# EAGLE schematic PGTNX01_teensy (EAGLE 9.6.0)
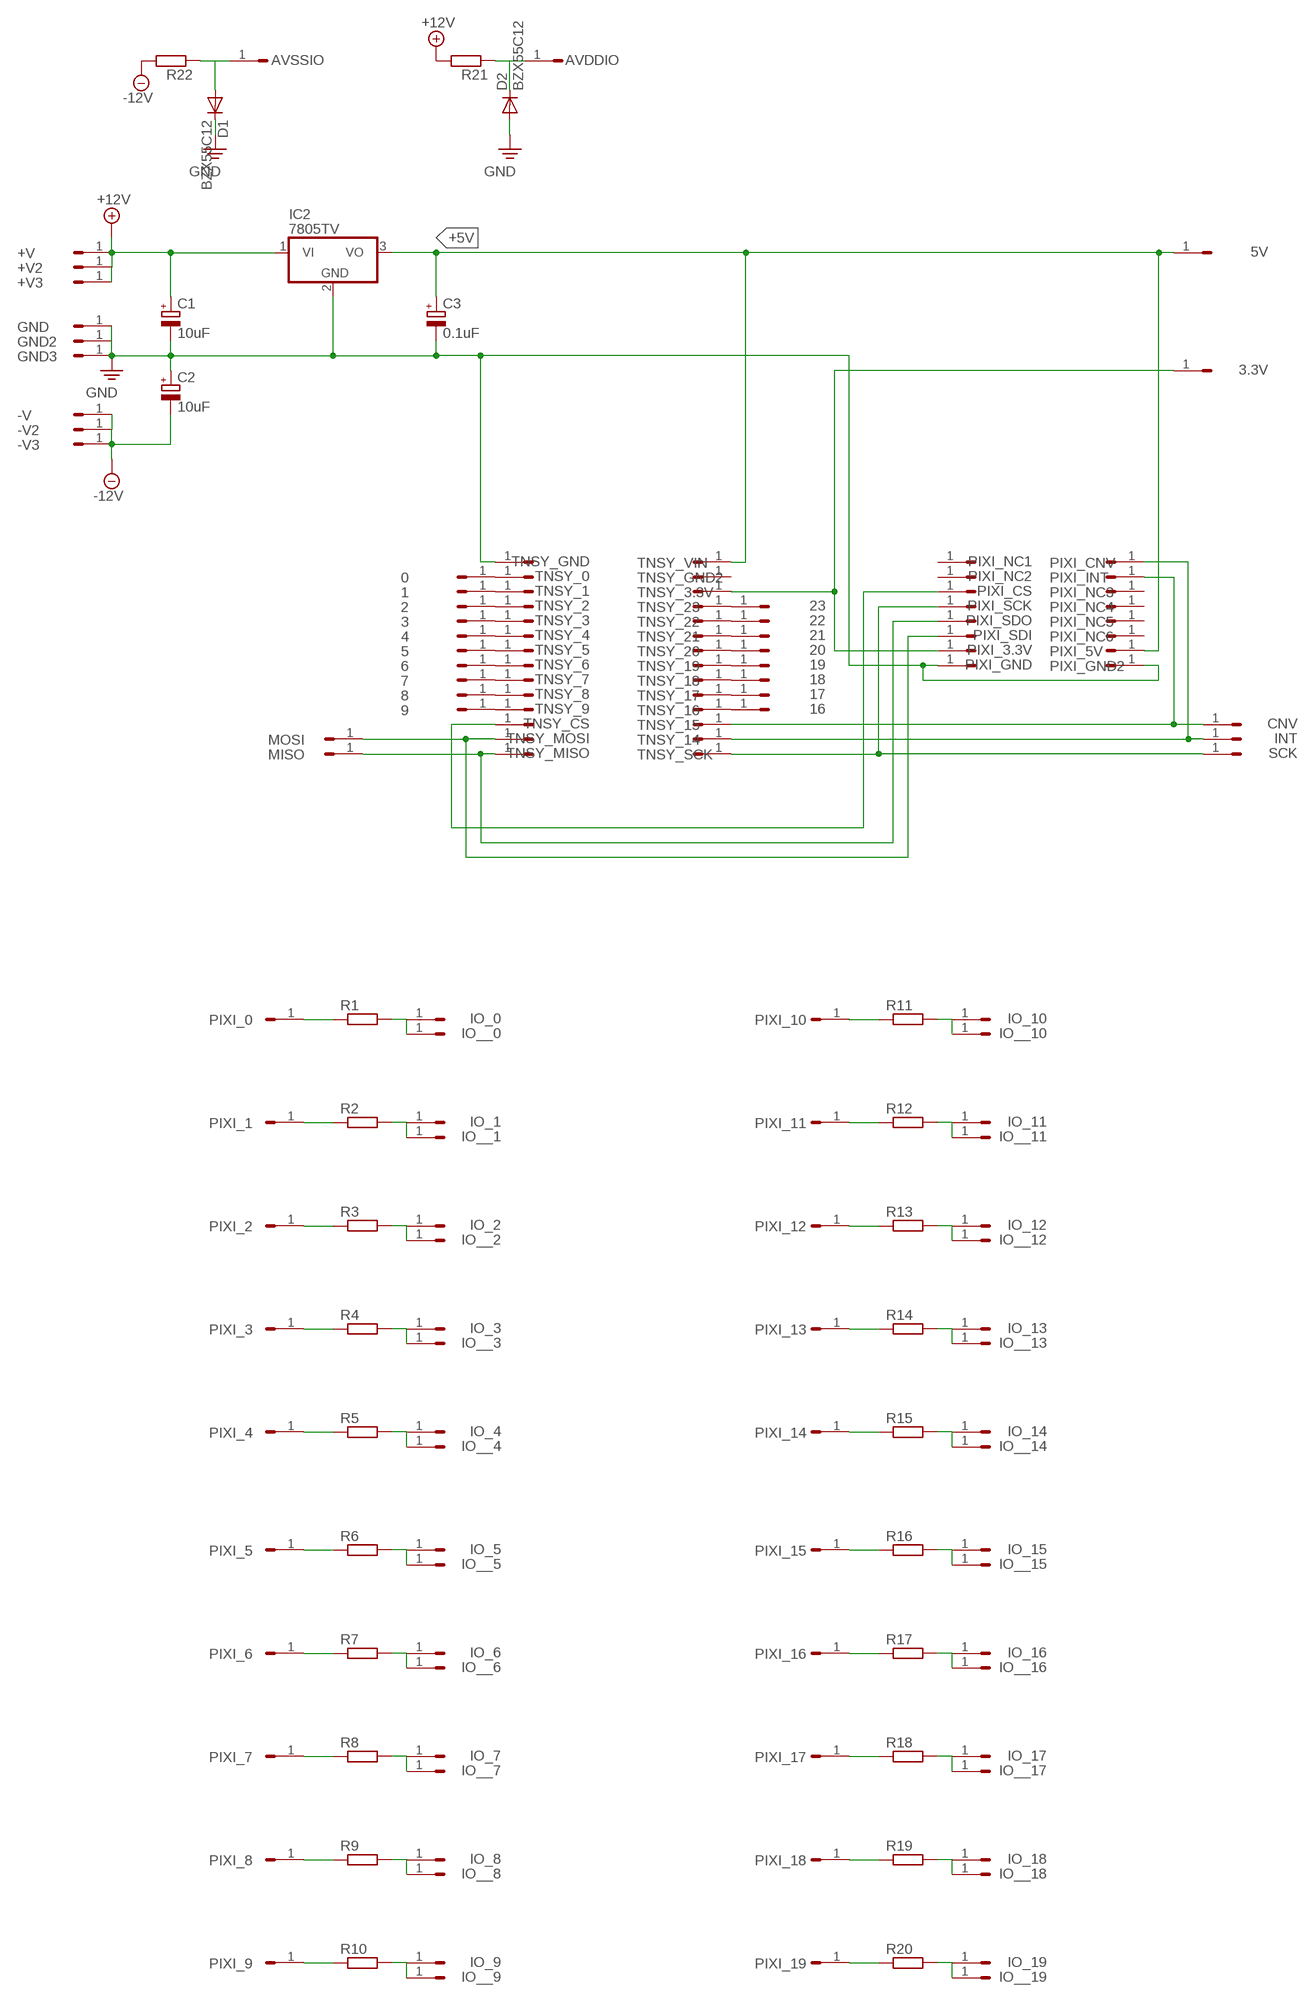
[diagram p0: schematic, sheet 1]

## Parts
0  HEADER/MALE/01  [HEADER/MALE/01]
1  HEADER/MALE/01  [HEADER/MALE/01]
2  HEADER/MALE/01  [HEADER/MALE/01]
3  HEADER/MALE/01  [HEADER/MALE/01]
3.3V  HEADER/MALE/01  [HEADER/MALE/01]
4  HEADER/MALE/01  [HEADER/MALE/01]
5  HEADER/MALE/01  [HEADER/MALE/01]
5V  HEADER/MALE/01  [HEADER/MALE/01]
6  HEADER/MALE/01  [HEADER/MALE/01]
7  HEADER/MALE/01  [HEADER/MALE/01]
8  HEADER/MALE/01  [HEADER/MALE/01]
9  HEADER/MALE/01  [HEADER/MALE/01]
16  HEADER/MALE/01  [HEADER/MALE/01]
17  HEADER/MALE/01  [HEADER/MALE/01]
18  HEADER/MALE/01  [HEADER/MALE/01]
19  HEADER/MALE/01  [HEADER/MALE/01]
20  HEADER/MALE/01  [HEADER/MALE/01]
21  HEADER/MALE/01  [HEADER/MALE/01]
22  HEADER/MALE/01  [HEADER/MALE/01]
23  HEADER/MALE/01  [HEADER/MALE/01]
+V  HEADER/MALE/01  [HEADER/MALE/01]
+V2  HEADER/MALE/01  [HEADER/MALE/01]
+V3  HEADER/MALE/01  [HEADER/MALE/01]
-V  HEADER/MALE/01  [HEADER/MALE/01]
-V2  HEADER/MALE/01  [HEADER/MALE/01]
-V3  HEADER/MALE/01  [HEADER/MALE/01]
AVDDIO  HEADER/MALE/01  [HEADER/MALE/01]
AVSSIO  HEADER/MALE/01  [HEADER/MALE/01]
C1  10uF  CAPACITOR/POLARIZEDE2.5-6  [E2,5-6]
C2  10uF  CAPACITOR/POLARIZEDE2.5-6  [E2,5-6]
C3  0.1uF  CAPACITOR/POLARIZEDE2.5-6  [E2,5-6]
CNV  HEADER/MALE/01  [HEADER/MALE/01]
D1  BZX55C12  1N4148DO35-7  [DO35-7]
D2  BZX55C12  1N4148DO35-7  [DO35-7]
GND  HEADER/MALE/01  [HEADER/MALE/01]
GND2  HEADER/MALE/01  [HEADER/MALE/01]
GND3  HEADER/MALE/01  [HEADER/MALE/01]
IC2  7805TV  [TO220V]
INT  HEADER/MALE/01  [HEADER/MALE/01]
IO_0  HEADER/MALE/01  [HEADER/MALE/01]
IO_1  HEADER/MALE/01  [HEADER/MALE/01]
IO_2  HEADER/MALE/01  [HEADER/MALE/01]
IO_3  HEADER/MALE/01  [HEADER/MALE/01]
IO_4  HEADER/MALE/01  [HEADER/MALE/01]
IO_5  HEADER/MALE/01  [HEADER/MALE/01]
IO_6  HEADER/MALE/01  [HEADER/MALE/01]
IO_7  HEADER/MALE/01  [HEADER/MALE/01]
IO_8  HEADER/MALE/01  [HEADER/MALE/01]
IO_9  HEADER/MALE/01  [HEADER/MALE/01]
IO_10  HEADER/MALE/01  [HEADER/MALE/01]
IO_11  HEADER/MALE/01  [HEADER/MALE/01]
IO_12  HEADER/MALE/01  [HEADER/MALE/01]
IO_13  HEADER/MALE/01  [HEADER/MALE/01]
IO_14  HEADER/MALE/01  [HEADER/MALE/01]
IO_15  HEADER/MALE/01  [HEADER/MALE/01]
IO_16  HEADER/MALE/01  [HEADER/MALE/01]
IO_17  HEADER/MALE/01  [HEADER/MALE/01]
IO_18  HEADER/MALE/01  [HEADER/MALE/01]
IO_19  HEADER/MALE/01  [HEADER/MALE/01]
IO__0  HEADER/MALE/01  [HEADER/MALE/01]
IO__1  HEADER/MALE/01  [HEADER/MALE/01]
IO__2  HEADER/MALE/01  [HEADER/MALE/01]
IO__3  HEADER/MALE/01  [HEADER/MALE/01]
IO__4  HEADER/MALE/01  [HEADER/MALE/01]
IO__5  HEADER/MALE/01  [HEADER/MALE/01]
IO__6  HEADER/MALE/01  [HEADER/MALE/01]
IO__7  HEADER/MALE/01  [HEADER/MALE/01]
IO__8  HEADER/MALE/01  [HEADER/MALE/01]
IO__9  HEADER/MALE/01  [HEADER/MALE/01]
IO__10  HEADER/MALE/01  [HEADER/MALE/01]
IO__11  HEADER/MALE/01  [HEADER/MALE/01]
IO__12  HEADER/MALE/01  [HEADER/MALE/01]
IO__13  HEADER/MALE/01  [HEADER/MALE/01]
IO__14  HEADER/MALE/01  [HEADER/MALE/01]
IO__15  HEADER/MALE/01  [HEADER/MALE/01]
IO__16  HEADER/MALE/01  [HEADER/MALE/01]
IO__17  HEADER/MALE/01  [HEADER/MALE/01]
IO__18  HEADER/MALE/01  [HEADER/MALE/01]
IO__19  HEADER/MALE/01  [HEADER/MALE/01]
MISO  HEADER/MALE/01  [HEADER/MALE/01]
MOSI  HEADER/MALE/01  [HEADER/MALE/01]
PIXI_0  HEADER/MALE/01  [HEADER/MALE/01]
PIXI_1  HEADER/MALE/01  [HEADER/MALE/01]
PIXI_2  HEADER/MALE/01  [HEADER/MALE/01]
PIXI_3  HEADER/MALE/01  [HEADER/MALE/01]
PIXI_3.3V  HEADER/MALE/01  [HEADER/MALE/01]
PIXI_4  HEADER/MALE/01  [HEADER/MALE/01]
PIXI_5  HEADER/MALE/01  [HEADER/MALE/01]
PIXI_5V  HEADER/MALE/01  [HEADER/MALE/01]
PIXI_6  HEADER/MALE/01  [HEADER/MALE/01]
PIXI_7  HEADER/MALE/01  [HEADER/MALE/01]
PIXI_8  HEADER/MALE/01  [HEADER/MALE/01]
PIXI_9  HEADER/MALE/01  [HEADER/MALE/01]
PIXI_10  HEADER/MALE/01  [HEADER/MALE/01]
PIXI_11  HEADER/MALE/01  [HEADER/MALE/01]
PIXI_12  HEADER/MALE/01  [HEADER/MALE/01]
PIXI_13  HEADER/MALE/01  [HEADER/MALE/01]
PIXI_14  HEADER/MALE/01  [HEADER/MALE/01]
PIXI_15  HEADER/MALE/01  [HEADER/MALE/01]
PIXI_16  HEADER/MALE/01  [HEADER/MALE/01]
PIXI_17  HEADER/MALE/01  [HEADER/MALE/01]
PIXI_18  HEADER/MALE/01  [HEADER/MALE/01]
PIXI_19  HEADER/MALE/01  [HEADER/MALE/01]
PIXI_CNV  HEADER/MALE/01  [HEADER/MALE/01]
PIXI_CS  HEADER/MALE/01  [HEADER/MALE/01]
PIXI_GND  HEADER/MALE/01  [HEADER/MALE/01]
PIXI_GND2  HEADER/MALE/01  [HEADER/MALE/01]
PIXI_INT  HEADER/MALE/01  [HEADER/MALE/01]
PIXI_NC1  HEADER/MALE/01  [HEADER/MALE/01]
PIXI_NC2  HEADER/MALE/01  [HEADER/MALE/01]
PIXI_NC3  HEADER/MALE/01  [HEADER/MALE/01]
PIXI_NC4  HEADER/MALE/01  [HEADER/MALE/01]
PIXI_NC5  HEADER/MALE/01  [HEADER/MALE/01]
PIXI_NC6  HEADER/MALE/01  [HEADER/MALE/01]
PIXI_SCK  HEADER/MALE/01  [HEADER/MALE/01]
PIXI_SDI  HEADER/MALE/01  [HEADER/MALE/01]
PIXI_SDO  HEADER/MALE/01  [HEADER/MALE/01]
R1  RESISTORRESISTOR/UPRIGHT/7.5  [RESISTOR/7.5]
R2  RESISTORRESISTOR/UPRIGHT/7.5  [RESISTOR/7.5]
R3  RESISTORRESISTOR/UPRIGHT/7.5  [RESISTOR/7.5]
R4  RESISTORRESISTOR/UPRIGHT/7.5  [RESISTOR/7.5]
R5  RESISTORRESISTOR/UPRIGHT/7.5  [RESISTOR/7.5]
R6  RESISTORRESISTOR/UPRIGHT/7.5  [RESISTOR/7.5]
R7  RESISTORRESISTOR/UPRIGHT/7.5  [RESISTOR/7.5]
R8  RESISTORRESISTOR/UPRIGHT/7.5  [RESISTOR/7.5]
R9  RESISTORRESISTOR/UPRIGHT/7.5  [RESISTOR/7.5]
R10  RESISTORRESISTOR/UPRIGHT/7.5  [RESISTOR/7.5]
R11  RESISTORRESISTOR/UPRIGHT/7.5  [RESISTOR/7.5]
R12  RESISTORRESISTOR/UPRIGHT/7.5  [RESISTOR/7.5]
R13  RESISTORRESISTOR/UPRIGHT/7.5  [RESISTOR/7.5]
R14  RESISTORRESISTOR/UPRIGHT/7.5  [RESISTOR/7.5]
R15  RESISTORRESISTOR/UPRIGHT/7.5  [RESISTOR/7.5]
R16  RESISTORRESISTOR/UPRIGHT/7.5  [RESISTOR/7.5]
R17  RESISTORRESISTOR/UPRIGHT/7.5  [RESISTOR/7.5]
R18  RESISTORRESISTOR/UPRIGHT/7.5  [RESISTOR/7.5]
R19  RESISTORRESISTOR/UPRIGHT/7.5  [RESISTOR/7.5]
R20  RESISTORRESISTOR/UPRIGHT/7.5  [RESISTOR/7.5]
R21  RESISTORRESISTOR/UPRIGHT/7.5  [RESISTOR/7.5]
R22  RESISTORRESISTOR/UPRIGHT/7.5  [RESISTOR/7.5]
SCK  HEADER/MALE/01  [HEADER/MALE/01]
TNSY_0  HEADER/MALE/01  [HEADER/MALE/01]
TNSY_1  HEADER/MALE/01  [HEADER/MALE/01]
TNSY_2  HEADER/MALE/01  [HEADER/MALE/01]
TNSY_3  HEADER/MALE/01  [HEADER/MALE/01]
TNSY_3.3V  HEADER/MALE/01  [HEADER/MALE/01]
TNSY_4  HEADER/MALE/01  [HEADER/MALE/01]
TNSY_5  HEADER/MALE/01  [HEADER/MALE/01]
TNSY_6  HEADER/MALE/01  [HEADER/MALE/01]
TNSY_7  HEADER/MALE/01  [HEADER/MALE/01]
TNSY_8  HEADER/MALE/01  [HEADER/MALE/01]
TNSY_9  HEADER/MALE/01  [HEADER/MALE/01]
TNSY_14  HEADER/MALE/01  [HEADER/MALE/01]
TNSY_15  HEADER/MALE/01  [HEADER/MALE/01]
TNSY_16  HEADER/MALE/01  [HEADER/MALE/01]
TNSY_17  HEADER/MALE/01  [HEADER/MALE/01]
TNSY_18  HEADER/MALE/01  [HEADER/MALE/01]
TNSY_19  HEADER/MALE/01  [HEADER/MALE/01]
TNSY_20  HEADER/MALE/01  [HEADER/MALE/01]
TNSY_21  HEADER/MALE/01  [HEADER/MALE/01]
TNSY_22  HEADER/MALE/01  [HEADER/MALE/01]
TNSY_23  HEADER/MALE/01  [HEADER/MALE/01]
TNSY_CS  HEADER/MALE/01  [HEADER/MALE/01]
TNSY_GND  HEADER/MALE/01  [HEADER/MALE/01]
TNSY_GND2  HEADER/MALE/01  [HEADER/MALE/01]
TNSY_MISO  HEADER/MALE/01  [HEADER/MALE/01]
TNSY_MOSI  HEADER/MALE/01  [HEADER/MALE/01]
TNSY_SCK  HEADER/MALE/01  [HEADER/MALE/01]
TNSY_VIN  HEADER/MALE/01  [HEADER/MALE/01]

## Nets
+5V: 5V.1 C3.+ IC2.3(VO) PIXI_5V.1 TNSY_VIN.1
+12V: +V2.1 +V3.1 +V.1 C1.+ IC2.1(VI) R21.2
-12V: -V2.1 -V3.1 -V.1 C2.- R22.2
GND: C1.- C2.+ C3.- D1.C D2.A GND2.1 GND3.1 GND.1 IC2.2(GND) PIXI_GND2.1 PIXI_GND.1 TNSY_GND.1
N$1: PIXI_0.1 R1.1
N$2: 17.1 TNSY_17.1
N$3: PIXI_1.1 R2.1
N$4: 16.1 TNSY_16.1
N$5: MOSI.1 PIXI_SDI.1 TNSY_MOSI.1
N$6: MISO.1 PIXI_SDO.1 TNSY_MISO.1
N$7: PIXI_SCK.1 SCK.1 TNSY_SCK.1
N$8: PIXI_CS.1 TNSY_CS.1
N$9: INT.1 PIXI_CNV.1 TNSY_14.1
N$10: CNV.1 PIXI_INT.1 TNSY_15.1
N$11: 18.1 TNSY_18.1
N$12: 19.1 TNSY_19.1
N$13: 20.1 TNSY_20.1
N$14: 21.1 TNSY_21.1
N$15: 22.1 TNSY_22.1
N$16: 23.1 TNSY_23.1
N$17: 0.1 TNSY_0.1
N$18: 1.1 TNSY_1.1
N$19: 2.1 TNSY_2.1
N$20: 3.1 TNSY_3.1
N$21: 4.1 TNSY_4.1
N$22: 5.1 TNSY_5.1
N$23: 6.1 TNSY_6.1
N$24: 7.1 TNSY_7.1
N$25: 8.1 TNSY_8.1
N$26: 9.1 TNSY_9.1
N$27: IO_1.1 IO__1.1 R2.2
N$28: 3.3V.1 PIXI_3.3V.1 TNSY_3.3V.1
N$29: IO_0.1 IO__0.1 R1.2
N$30: PIXI_2.1 R3.1
N$31: IO_2.1 IO__2.1 R3.2
N$32: PIXI_3.1 R4.1
N$33: IO_3.1 IO__3.1 R4.2
N$34: PIXI_4.1 R5.1
N$35: IO_4.1 IO__4.1 R5.2
N$36: PIXI_5.1 R6.1
N$37: IO_5.1 IO__5.1 R6.2
N$38: PIXI_6.1 R7.1
N$39: IO_6.1 IO__6.1 R7.2
N$40: PIXI_7.1 R8.1
N$41: IO_7.1 IO__7.1 R8.2
N$42: PIXI_8.1 R9.1
N$43: IO_8.1 IO__8.1 R9.2
N$44: PIXI_9.1 R10.1
N$45: IO_9.1 IO__9.1 R10.2
N$46: PIXI_10.1 R11.1
N$47: IO_10.1 IO__10.1 R11.2
N$48: PIXI_11.1 R12.1
N$49: IO_11.1 IO__11.1 R12.2
N$50: PIXI_12.1 R13.1
N$51: IO_12.1 IO__12.1 R13.2
N$52: PIXI_13.1 R14.1
N$53: IO_13.1 IO__13.1 R14.2
N$54: PIXI_14.1 R15.1
N$55: IO_14.1 IO__14.1 R15.2
N$56: PIXI_15.1 R16.1
N$57: IO_15.1 IO__15.1 R16.2
N$58: PIXI_16.1 R17.1
N$59: IO_16.1 IO__16.1 R17.2
N$60: PIXI_17.1 R18.1
N$61: IO_17.1 IO__17.1 R18.2
N$62: PIXI_18.1 R19.1
N$63: IO_18.1 IO__18.1 R19.2
N$64: PIXI_19.1 R20.1
N$65: IO_19.1 IO__19.1 R20.2
N$66: AVDDIO.1 D2.C R21.1
N$67: AVSSIO.1 D1.A R22.1
Unconnected: PIXI_NC1.1 PIXI_NC2.1 PIXI_NC3.1 PIXI_NC4.1 PIXI_NC5.1 PIXI_NC6.1 TNSY_GND2.1

## Library data of the parts
0 1-3 3.3V 4 5 5V 6-9 16-23 +V +V2 +V3 -V -V2 -V3 AVDDIO AVSSIO CNV GND GND2 GND3 INT IO_0 IO_1-IO_19 IO__0 IO__1-IO__19 MISO MOSI PIXI_0 PIXI_1-PIXI_3 PIXI_3.3V PIXI_4 PIXI_5 PIXI_5V PIXI_6-PIXI_19 PIXI_CNV PIXI_CS PIXI_GND PIXI_GND2 PIXI_INT PIXI_NC1-PIXI_NC6 PIXI_SCK PIXI_SDI PIXI_SDO SCK TNSY_0 TNSY_1-TNSY_3 TNSY_3.3V TNSY_4-TNSY_9 TNSY_14-TNSY_23 TNSY_CS TNSY_GND TNSY_GND2 TNSY_MISO TNSY_MOSI TNSY_SCK TNSY_VIN = connectors:HEADER/MALE/01; SPICEPREFIX: X
C1-C3 = capacitors:CAPACITOR/POLARIZED: POLARIZED CAPACITOR, European symbol; SPICEPREFIX: C
D1 D2 = transistors:1N4148: DIODE high speed (Philips)
IC2 = ic_voltage_reg:78*: Positive VOLTAGE REGULATOR Source: http://cache.national.com/ds/LM/LM78L05.pdf http://www.fairchildsemi.com/ds/LM/LM7805.pdf
R1-R22 = resistors:RESISTOR: RESISTOR, European symbol